# Altium project Jetson Nano Power -2.PrjPcb
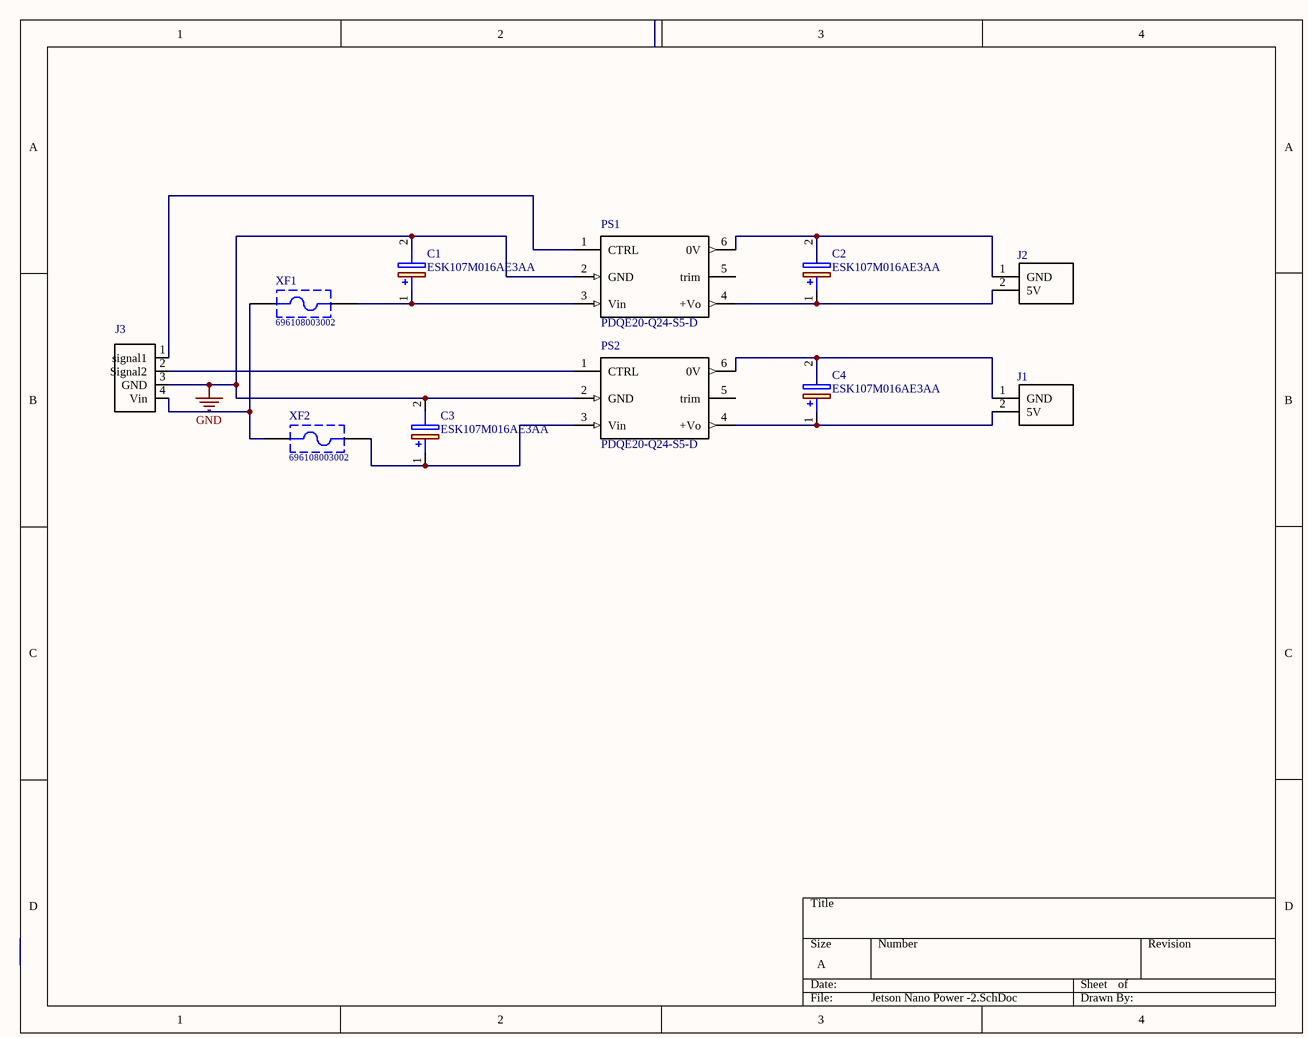
[diagram p0: Jetson Nano Power -2.SchDoc]
1 sheet, 11 parts. Net scope: global (net labels, ports and power ports of the same name join across sheets).
Board file: Jetson Nano Power -2.PcbDoc

## Sheet Jetson Nano Power -2.SchDoc
size A

### Parts
C1  ESK107M016AE3AA  [CAPPRD250W50D630H1250]
C2  ESK107M016AE3AA  [CAPPRD250W50D630H1250]
C3  ESK107M016AE3AA  [CAPPRD250W50D630H1250]
C4  ESK107M016AE3AA  [CAPPRD250W50D630H1250]
J1  282856-2  [*TE_282856-2]  (value not drawn)
J2  282856-2  [*TE_282856-2]  (value not drawn)
J3  282836-4  [*TE_282836-4]  (value not drawn)
PS1  PDQE20-Q24-S5-D  [*CONV_PDQE20-Q24-S5-D]
PS2  PDQE20-Q24-S5-D  [*CONV_PDQE20-Q24-S5-D]
XF1  696108003002  [696108003002]
XF2  696108003002  [696108003002]

### Nets
GND: C1.2(-) C3.2(-) J3.3(GND) PS1.2(GND) PS2.2(GND)
NetC1_1: C1.1(+) PS1.3(Vin) XF1.2
NetC2_1: C2.1(+) J2.2(5V) PS1.4(+Vo)
NetC2_2: C2.2(-) J2.1(GND) PS1.6(0V)
NetC3_1: C3.1(+) PS2.3(Vin) XF2.2
NetC4_1: C4.1(+) J1.2(5V) PS2.4(+Vo)
NetC4_2: C4.2(-) J1.1(GND) PS2.6(0V)
NetJ3_1: J3.1(signal1) PS1.1(CTRL)
NetJ3_2: J3.2(Signal2) PS2.1(CTRL)
NetJ3_4: J3.4(Vin) XF1.1 XF2.1

Not connected (* = marked no-connect by the designer): PS1 5(trim); PS2 5(trim)

### Library data of the parts
C1-C4 = ESK107M016AE3AA: Capacitor Polarised; Manufacturer_Name: Kemet; Datasheet Link: https://api.kemet.com/component-edge/download/datasheet/ESK107M016AE3AA.pdf; Height: 12.5mm; Manufacturer_Part_Number: ESK107M016AE3AA
J1 J2 = 282856-2: TERMI-BLOK PCB MOUNT 2P; MF: TE Connectivity; TE_purchase_URL: https://www.te.com/usa-en/product-282856-2.html?te_bu=Cor&te_type=disp&te_campaign=seda_glo_cor-seda-global-disp-prtnr-fy19-seda-model-bom-cta_sma-317_1&elqCampaignId=32493; Price: None; MP: 282856-2; SnapEDA_Link: https://www.snapeda.com/parts/282856-2/TE%20Connectivity%20AMP%20Connectors/view-part/1809079/?ref=snap; EU_RoHS_Compliance: Compliant with Exemptions; Package: None; Availability: Unavailable; Value: *
J3 = 282836-4: 4 Position Wire to Board Terminal Block Horizontal with Board 0.197 _5.00mm_ Through Hole; Number_of_Positions: 4; MF: TE Connectivity; Centerline_Pitch: 5 mm[.197 in]; TE_purchase_URL: https://www.te.com/usa-en/product-282836-4.html?te_bu=Cor&te_type=disp&te_campaign=seda_glo_cor-seda-global-disp-prtnr-fy19-seda-model-bom-cta_sma-317_1&elqCampaignId=32493; MP: 282836-4; Package: None; Availability: Unavailable; SnapEDA_Link: https://www.snapeda.com/parts/282836-4/TE%20Connectivity%20AMP%20Connectors/view-part/493249/?ref=snap; EU_RoHS_Compliance: Compliant with Exemptions; Price: None; Value: *
PS1 PS2 = PDQE20-Q24-S5-D: 20 W, 4:1 Input Range, Single/Dual Regulated Output, DIP, 1500 Vdc Isolation, Dc-Dc Converter; MF: CUI Inc.; Digi-Key_Purchase_URL: https://www.digikey.com/product-detail/en/cui-inc/PDQE20-Q24-S5-D/102-6267-ND/10230156?utm_source=snapeda&utm_medium=aggregator&utm_campaign=symbol; CUI_purchase_URL: https://www.cui.com/product/dc-dc-converters/isolated/pdqe20-d-series?utm_source=snapeda.com&utm_medium=referral&utm_campaign=snapedaBOM; Digi-Key_Part_Number: 102-6267-ND; Package: DIP-6 CUI Inc.; SnapEDA_Link: https://www.snapeda.com/parts/PDQE20-Q24-S5-D/CUI/view-part/3740268/?ref=snap; MP: PDQE20-Q24-S5-D; Value: *
XF1 XF2 = CMP-1502-00237-1: WR-FSH Fuse Holder Blocks Fuse Holder Blocks Clip Cover for PCB; Manufacturer: Wurth Elektronik; Fuse Size: 5x20mm; Operating Temperature: -30to120degC; Datasheet URL: https://katalog.we-online.de/em/datasheet/696108003002.pdf; Mounting Technology: THT; Package Reference: 696108003002; Part Number: 696108003002; Manufacturer URL: http://www.we-online.de; Packaging: Box; Publisher: WurthElektronik